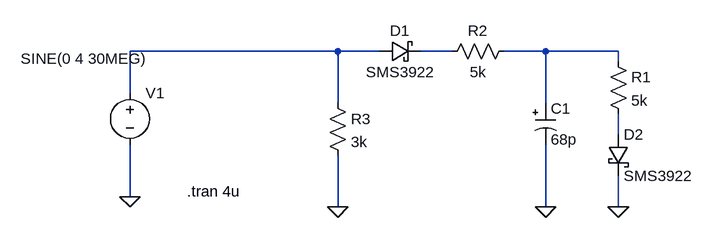
[diagram p0: schematic SQRL_Resonator_HALF_Wave_Bridge_Rectifier_RF_Diode.asc]
SQRL_Resonator_HALF_Wave_Bridge_Rectifier_RF_Diode.asc, the LTspice schematic file:
Version 4
SHEET 1 1508 680
WIRE 624 32 304 32
WIRE 688 32 624 32
WIRE 800 32 752 32
WIRE 944 32 880 32
WIRE 1056 32 944 32
WIRE 1056 48 1056 32
WIRE 304 96 304 32
WIRE 624 112 624 32
WIRE 944 112 944 32
WIRE 1056 160 1056 128
WIRE 304 256 304 176
WIRE 624 272 624 192
WIRE 944 272 944 176
WIRE 1056 272 1056 224
FLAG 304 256 0
FLAG 1056 272 0
FLAG 944 272 0
FLAG 624 272 0
SYMBOL voltage 304 80 R0
WINDOW 3 -168 -37 Left 2
WINDOW 123 24 124 Left 2
WINDOW 39 0 0 Left 0
SYMATTR Value SINE(0 4 30MEG)
SYMATTR InstName V1
SYMBOL res 1040 32 R0
SYMATTR InstName R1
SYMATTR Value 5k
SYMBOL res 896 16 R90
WINDOW 0 0 56 VBottom 2
WINDOW 3 32 56 VTop 2
SYMATTR InstName R2
SYMATTR Value 5k
SYMBOL res 608 96 R0
SYMATTR InstName R3
SYMATTR Value 3k
SYMBOL polcap 928 112 R0
WINDOW 3 24 56 Left 2
SYMATTR Value 68p
SYMATTR InstName C1
SYMATTR Description Capacitor
SYMATTR Type cap
SYMATTR SpiceLine V=50 Irms=6.2m Rser=2.668 Lser=852p
SYMBOL schottky 688 48 R270
WINDOW 0 32 32 VTop 2
WINDOW 3 0 32 VBottom 2
SYMATTR InstName D1
SYMATTR Value SMS3922
SYMATTR Description Diode
SYMATTR Type diode
SYMBOL schottky 1040 160 R0
SYMATTR InstName D2
SYMATTR Value SMS3922
SYMATTR Description Diode
SYMATTR Type diode
TEXT 392 248 Left 2 !.tran 4u

The netlist it stands for:
* SQRL_Resonator_HALF_Wave_Bridge_Rectifier_RF_Diode.asc
V1 N001 0 SINE(0 4 30MEG)
R1 N003 N004 5k
R2 N003 N002 5k
R3 N001 0 3k
C1 N003 0 68p V=50 Irms=6.2m Rser=2.668 Lser=852p
D1 N001 N002 SMS3922
D2 N004 0 SMS3922
.model D D
.lib standard.dio
.tran 4u
.backanno
.end